# EAGLE design Fabrickit-Bare-Brick (EAGLE 6.4)
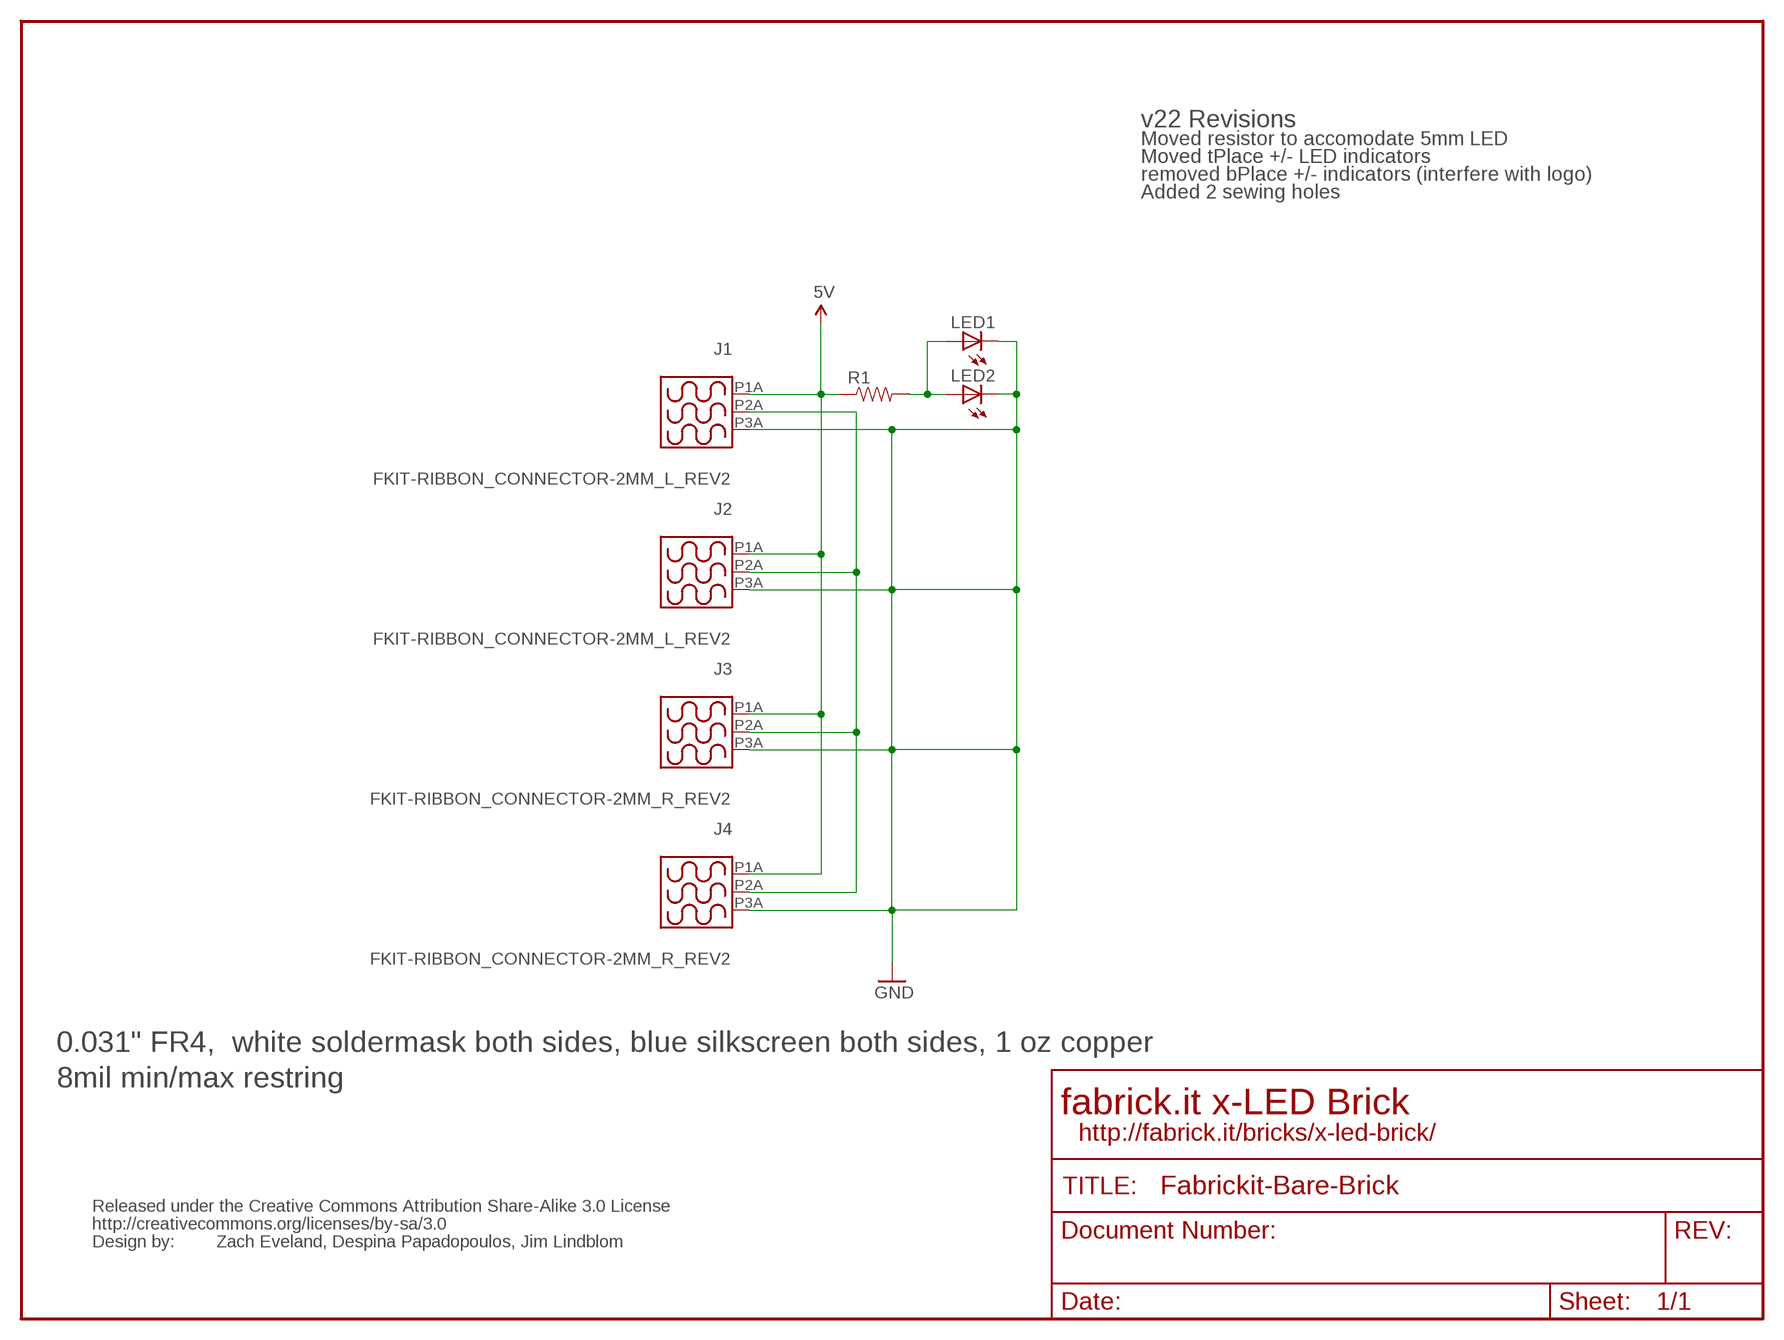
[diagram p0: schematic, sheet 1]

## Parts
J1  FKIT-RIBBON_CONNECTOR-2MM_L_REV2  [FKIT-RIBBON_CONNECTOR_03_2MM_L]
J2  FKIT-RIBBON_CONNECTOR-2MM_L_REV2  [FKIT-RIBBON_CONNECTOR_03_2MM_L]
J3  FKIT-RIBBON_CONNECTOR-2MM_R_REV2  [FKIT-RIBBON_CONNECTOR_03_2MM_R]
J4  FKIT-RIBBON_CONNECTOR-2MM_R_REV2  [FKIT-RIBBON_CONNECTOR_03_2MM_R]
LED1  LED  [FKIT-LED-1206_NO_CREAM]
LED2  LED-3MM-NO_SILK  [LED3MM-NS]
R1  RESISTOR0603  [0603-RES]
U$1  CREATIVE_COMMONS  [CREATIVE_COMMONS]

## Nets
5V: J1.P1A J2.P1A J3.P1A J4.P1A R1.1
GND: J1.P3A J2.P3A J3.P3A J4.P3A LED1.C LED2.K(C)
N$2: J1.P2A J2.P2A J3.P2A J4.P2A
N$4: LED1.A LED2.A R1.2

## Notes on the sheet
- v22 Revisions
- Moved resistor to accomodate 5mm LED
- Moved tPlace +/- LED indicators
- removed bPlace +/- indicators (interfere with logo)
- Added 2 sewing holes
- 0.031" FR4,  white soldermask both sides, blue silkscreen both sides, 1 oz copper
- 8mil min/max restring
- fabrick.it x-LED Brick
- http://fabrick.it/bricks/x-led-brick/
- Zach Eveland, Despina Papadopoulos, Jim Lindblom

## Library data of the parts
J1-J4 = SparkFun:FKIT-RIBBON_CONNECTOR: fabrick.it Conductive Ribbon Connector
LED1 = Testing:LED: LEDs Standard schematic elements and footprints for 5mm, 3mm, 1206, and 0603 sized LEDs. 5mm - Spark Fun Electronics SKU : COM-00529 (and others)
LED2 = SparkFun:LED: LEDs Standard schematic elements and footprints for 5mm, 3mm, 1206, and 0603 sized LEDs. 5mm - Spark Fun Electronics SKU : COM-00529 (and others)
R1 = SparkFun-Resistors:RESISTOR: Resistor Basic schematic elements and footprints for 0603, 1206, and PTH resistors.
U$1 = SparkFun:CREATIVE_COMMONS

## Board
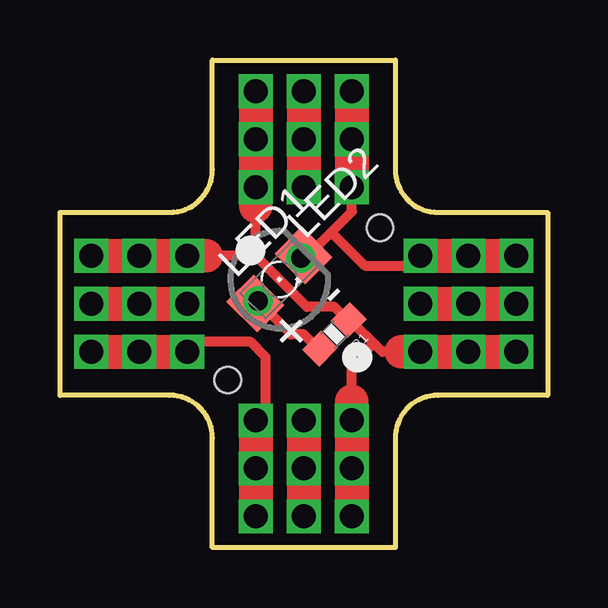
[diagram p1: board, top side]
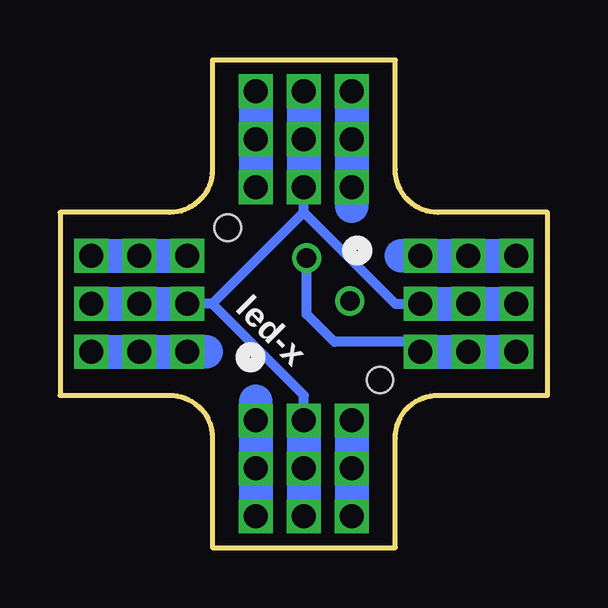
[diagram p2: board, bottom side, seen from below]

Size 20.32 x 20.32 mm. Coordinates in mm from the lower left corner, seen from the top.
Outline: 6.35,20.32 13.97,20.32 13.97,15.75 arc90 15.75,13.97 20.32,13.97 20.32,6.35 15.75,6.35 arc90 13.97,4.57 13.97,0 6.35,0 6.35,4.57 arc90 4.57,6.35 0,6.35 0,13.97 4.57,13.97 arc90 6.35,15.75 6.35,20.32
Copper layers (1*16): Top 0.035mm / dielectric 1.5mm / Bottom 0.035mm
Design rules "SparkFun *": minimum track width 8mil, minimum drill 20mil, track to track 8mil, track to pad 8mil, pad to pad 8mil, via to via 8mil, smd to smd 8mil, copper to edge 8mil, drill to drill 8mil, minimum pad ring 8mil, minimum via ring 10mil, stop-mask expansion 4mil, vias tented up to drill 20mil, thermal gap 10mil
Holes 1.1 mm at 13.34,13.34 6.99,6.99

### Footprints (pad centres in the part's own frame; a part is rotated, then mirrored left to right if it is on the bottom)
FKIT-RIBBON_CONNECTOR_03_2MM_L = drill 1 pad 1.3 square: P1A -2,2; P1B -2,0; P1C -2,-2; P2A 0,2; P2B 0,0; P2C 0,-2; P3A 2,2; P3B 2,0; P3C 2,-2
FKIT-RIBBON_CONNECTOR_03_2MM_R = drill 1 pad 1.3 square: P1A 2,2; P1B 2,0; P1C 2,-2; P2A 0,2; P2B 0,0; P2C 0,-2; P3A -2,2; P3B -2,0; P3C -2,-2
FKIT-LED-1206_NO_CREAM = smd 1.6 x 1.803: A -1.422,0; C 1.422,0
LED3MM-NS = drill 0.813: A -1.27,0; K 1.27,0
0603-RES = smd 1.1 x 1: 1 -0.85,0; 2 0.85,0

### Placement (x,y rotation side)
J1  3.3,10.16 270 top
J2  17.02,10.16 90 top
J3  10.16,3.3 0 top
J4  10.16,17.02 180 top
LED1  9.14,11.18 45 top
LED2  9.14,11.18 45 top
R1  11.43,8.89 225 top
U$1  0,-6.35 0 top  (outside the outline)

### Tracks (layer width: path | path; a pad name or v marks a point on that pad's centre or on a via)
5V
  Top 0.406: 8.16,12.16 J4.P1A | 8.16,12.16 10.29,10.03 11.43,10.03 11.89,9.57 11.89,9.32 | 8.16,12.16 J1.P1A | 11.89,9.32 R1.1 | 11.89,9.32 12.27,9.32 13.08,8.51 | J2.P1A 13.43,8.16 13.08,8.51 | J3.P1A 12.16,7.59 13.08,8.51
GND
  Top 0.406: J4.P3A 12.16,14 11.3,13.14 | 11.3,13.14 10.34,12.18 LED1.C LED2.K | J2.P3A | J2.P3A 14.61,11.75 12.7,11.75 11.3,13.14 | J1.P3A 5.71,8.57 7.94,8.57 8.57,7.94 8.57,5.71 J3.P3A
  Bottom 0.406: LED2.K 10.04,9.72 8.89,8.57 5.71,8.57 J1.P3A
N$2
  Bottom 0.406: J3.P2A 10.16,6.35 13.97,10.16 | 13.97,10.16 J2.P2A | 13.97,10.16 10.16,13.97 | 10.16,13.97 J4.P2A | J1.P2A 6.35,10.16 10.16,13.97
N$4
  Top 0.406: LED1.A LED2.A 9.25,9.27 9.63,8.89 10.16,8.89 10.76,8.29 R1.2

### Text on the board
tPlace: - | +
bPlace: led-x